# EAGLE design ESP32 - Copy (EAGLE 9.6.2)
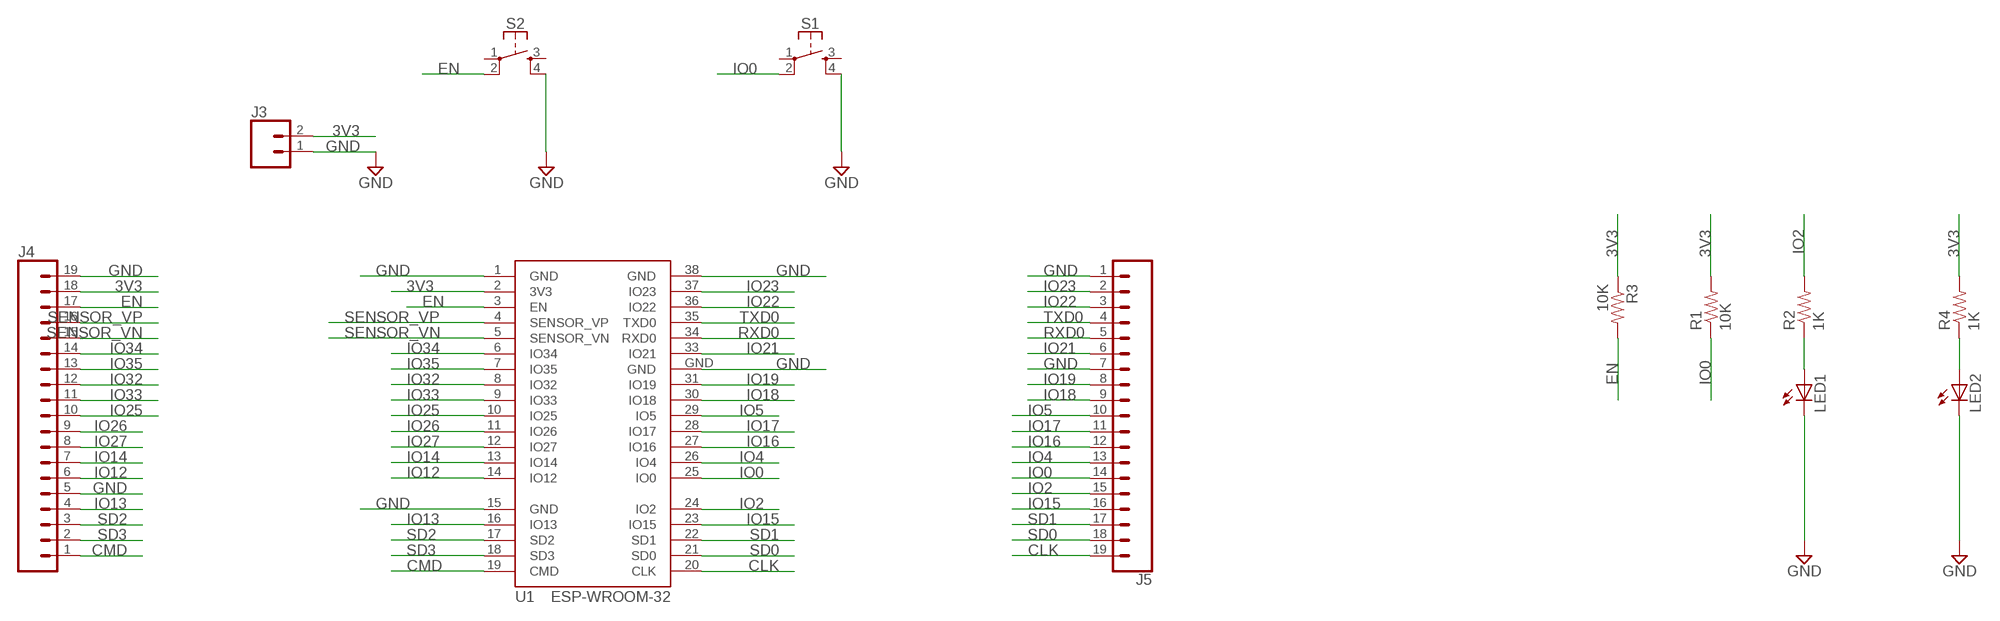
[diagram p0: schematic, sheet 1]

## Parts
J3  CONN_02  [1X02]
J4  CONN_191X19_NO_SILK  [1X19_NO_SILK]
J5  CONN_191X19_NO_SILK  [1X19_NO_SILK]
LED1  LED5MM  [LED5MM]
LED2  LED5MM  [LED5MM]
R1  10K  R-US_0207/10  [0207/10]
R2  1K  R-US_0207/10  [0207/10]
R3  10K  R-US_0207/10  [0207/10]
R4  1K  R-US_0207/10  [0207/10]
S1  MOMENTARY-SWITCH-SPST-2-SMD-5.2MM-TALL  [TACTILE_SWITCH_SMD_5.2MM]
S2  MOMENTARY-SWITCH-SPST-2-SMD-5.2MM-TALL  [TACTILE_SWITCH_SMD_5.2MM]
U1  ESP-WROOM-32  [ESP-WROOM-32]

## Nets
3V3: J3.2 J4.18 R1.2 R3.1 R4.2 U1.2(3V3)
CLK: J5.19 U1.20(CLK)
CMD: J4.1 U1.19(CMD)
EN: J4.17 R3.2 S2.2 U1.3(EN)
GND: J3.1 J4.5 J4.19 J5.1 J5.7 LED1.K(C) LED2.K(C) S1.4 S2.4 U1.1(GND) U1.15(GND) U1.38(GND) U1.GND
IO0: J5.14 R1.1 S1.2 U1.25(IO0)
IO2: J5.15 R2.2 U1.24(IO2)
IO4: J5.13 U1.26(IO4)
IO5: J5.10 U1.29(IO5)
IO12: J4.6 U1.14(IO12)
IO13: J4.4 U1.16(IO13)
IO14: J4.7 U1.13(IO14)
IO15: J5.16 U1.23(IO15)
IO16: J5.12 U1.27(IO16)
IO17: J5.11 U1.28(IO17)
IO18: J5.9 U1.30(IO18)
IO19: J5.8 U1.31(IO19)
IO21: J5.6 U1.33(IO21)
IO22: J5.3 U1.36(IO22)
IO23: J5.2 U1.37(IO23)
IO25: J4.10 U1.10(IO25)
IO26: J4.9 U1.11(IO26)
IO27: J4.8 U1.12(IO27)
IO32: J4.12 U1.8(IO32)
IO33: J4.11 U1.9(IO33)
IO34: J4.14 U1.6(IO34)
IO35: J4.13 U1.7(IO35)
N$1: LED1.A R2.1
N$2: LED2.A R4.1
RXD0: J5.5 U1.34(RXD0)
SD0: J5.18 U1.21(SD0)
SD1: J5.17 U1.22(SD1)
SD2: J4.3 U1.17(SD2)
SD3: J4.2 U1.18(SD3)
SENSOR_VN: J4.15 U1.5(SENSOR_VN)
SENSOR_VP: J4.16 U1.4(SENSOR_VP)
TXD0: J5.4 U1.35(TXD0)
Unconnected: S1.1 S1.3 S2.1 S2.3

## Library data of the parts
J3 = SparkFun-Connectors:CONN_02: Multi connection point. Often used as Generic Header-pin footprint for 0.1 inch spaced/style header connections On any of the 0.1 inch spaced packages, you can populate with these: Break Away Headers - Straight <https://www.sparkfun.com/products/116> (PRT-00116) Break Away Male Headers - Right Angle <https://www.sparkfun.com/products/553> (PRT-00553) Female Headers <https://www.sparkfun.com/products/115> (PRT-00115) Break Away Headers - Machine Pin <https://www.sparkfun.com/products/117> (PRT-00117) Break Away Female Headers - Swiss Machine Pin <https://www.sparkfun.com/products/743> (PRT-00743) For SCREWTERMINALS and SPRING TERMINALS visit here: Screw Terimnals on SparkFun.com <https://www.sparkfun.com/search/results?term=Screw+Terminals> (5mm/3.5mm/2.54mm spacing) This device is also useful as a general connection point to wire up your design to another part of your project. Our various solder wires solder well into these plated through hole pads. Hook-Up Wire - Assortment (Stranded, 22 AWG) <https://www.sparkfun.com/products/11375> (PRT-11375) Hook-Up Wire - Assortment (Solid Core, 22 AWG) <https://www.sparkfun.com/products/11367> (PRT-11367) View the entire wire category on our website here <https://www.sparkfun.com/categories/141> Special notes: Molex polarized connector foot print use with: PRT-08233 with associated crimp pins and housings. 2.54_SCREWTERM for use with PRT-10571. 3.5mm Screw Terminal footprints for PRT-08084 5mm Screw Terminal footprints for use with PRT-08432
J4 J5 = SparkFun-Connectors:CONN_19: Multi connection point. Often used as Generic Header-pin footprint for 0.1 inch spaced/style header connections On any of the 0.1 inch spaced packages, you can populate with these: Break Away Headers - Straight <https://www.sparkfun.com/products/116> (PRT-00116) Break Away Male Headers - Right Angle <https://www.sparkfun.com/products/553> (PRT-00553) Female Headers <https://www.sparkfun.com/products/115> (PRT-00115) Break Away Headers - Machine Pin <https://www.sparkfun.com/products/117> (PRT-00117) Break Away Female Headers - Swiss Machine Pin <https://www.sparkfun.com/products/743> (PRT-00743) For SCREWTERMINALS and SPRING TERMINALS visit here: Screw Terimnals on SparkFun.com <https://www.sparkfun.com/search/results?term=Screw+Terminals> (5mm/3.5mm/2.54mm spacing) This device is also useful as a general connection point to wire up your design to another part of your project. Our various solder wires solder well into these plated through hole pads. Hook-Up Wire - Assortment (Stranded, 22 AWG) <https://www.sparkfun.com/products/11375> (PRT-11375) Hook-Up Wire - Assortment (Solid Core, 22 AWG) <https://www.sparkfun.com/products/11367> (PRT-11367) View the entire wire category on our website here <https://www.sparkfun.com/categories/141> Special notes: Molex polarized connector foot print use with SKU : PRT-08231 with associated crimp pins and housings. 1MM SMD Version SKU: PRT-10208 NOTES ON THE VARIANTS LOCK and LOCK_LONGPADS... This footprint was designed to help hold the alignment of a through-hole component (i.e. 6-pin header) while soldering it into place. You may notice that each hole has been shifted either up or down by 0.005 of an inch from it's more standard position (which is a perfectly straight line). This slight alteration caused the pins (the squares in the middle) to touch the edges of the holes. Because they are alternating, it causes a "brace" to hold the component in place. 0.005 has proven to be the perfect amount of "off-center" position when using our standard breakaway headers. Although looks a little odd when you look at the bare footprint, once you have a header in there, the alteration is very hard to notice. Also,if you push a header all the way into place, it is covered up entirely on the bottom side.
LED1 LED2 = adafruit:LED: LED OSRAM: - CHIPLED LG R971, LG N971, LY N971, LG Q971, LY Q971, LO R971, LY R971 LH N974, LH R974 LS Q976, LO Q976, LY Q976 LO Q996 - Hyper CHIPLED LW Q18S LB Q993, LB Q99A, LB R99A - SideLED LS A670, LO A670, LY A670, LG A670, LP A670 LB A673, LV A673, LT A673, LW A673 LH A674 LY A675 LS A676, LA A676, LO A676, LY A676, LW A676 LS A679, LY A679, LG A679 - Hyper Micro SIDELED® LS Y876, LA Y876, LO Y876, LY Y876 LT Y87S - SmartLED LW L88C, LW L88S LB L89C, LB L89S, LG L890 LS L89K, LO L89K, LY L89K LS L896, LA L896, LO L896, LY L896 - TOPLED LS T670, LO T670, LY T670, LG T670, LP T670 LSG T670, LSP T670, LSY T670, LOP T670, LYG T670 LG T671, LOG T671, LSG T671 LB T673, LV T673, LT T673, LW T673 LH T674 LS T676, LA T676, LO T676, LY T676, LB T676, LH T676, LSB T676, LW T676 LB T67C, LV T67C, LT T67C, LS T67K, LO T67K, LY T67K, LW E67C LS E67B, LA E67B, LO E67B, LY E67B, LB E67C, LV E67C, LT E67C LW T67C LS T679, LY T679, LG T679 LS T770, LO T770, LY T770, LG T770, LP T770 LB T773, LV T773, LT T773, LW T773 LH T774 LS E675, LA E675, LY E675, LS T675 LS T776, LA T776, LO T776, LY T776, LB T776 LHGB T686 LT T68C, LB T68C - Hyper Mini TOPLED® LB M676 - Mini TOPLED Santana® LG M470 LS M47K, LO M47K, LY M47K Source: http://www.osram.convergy.de/
R1-R4 = adafruit:R-US_: RESISTOR, American symbol
S1 S2 = SparkFun-Switches:MOMENTARY-SWITCH-SPST-2: Momentary Switch (Pushbutton) - SPST - Two Circuits Normally-open (NO) SPST momentary switches (buttons, pushbuttons). Schematic symbol includes two switch circuits. Variants SMD-4.6MMX2.8MM - 4.60mm x 2.80mm Tactile Momentary Button Switch - Used on SparkFun SAMD21 Mini Breakout <https://www.sparkfun.com/products/13664> SMD-5.2MM - Mini Pushbutton Switch - SMD <https://www.sparkfun.com/products/8720> - Used on Arduino Pro Mini <https://www.sparkfun.com/products/11114>; PROD_ID: SWCH-14139
U1 = ESP32:ESP-WROOM-32: Espressif Systems ESP-WROOM-32

## Board
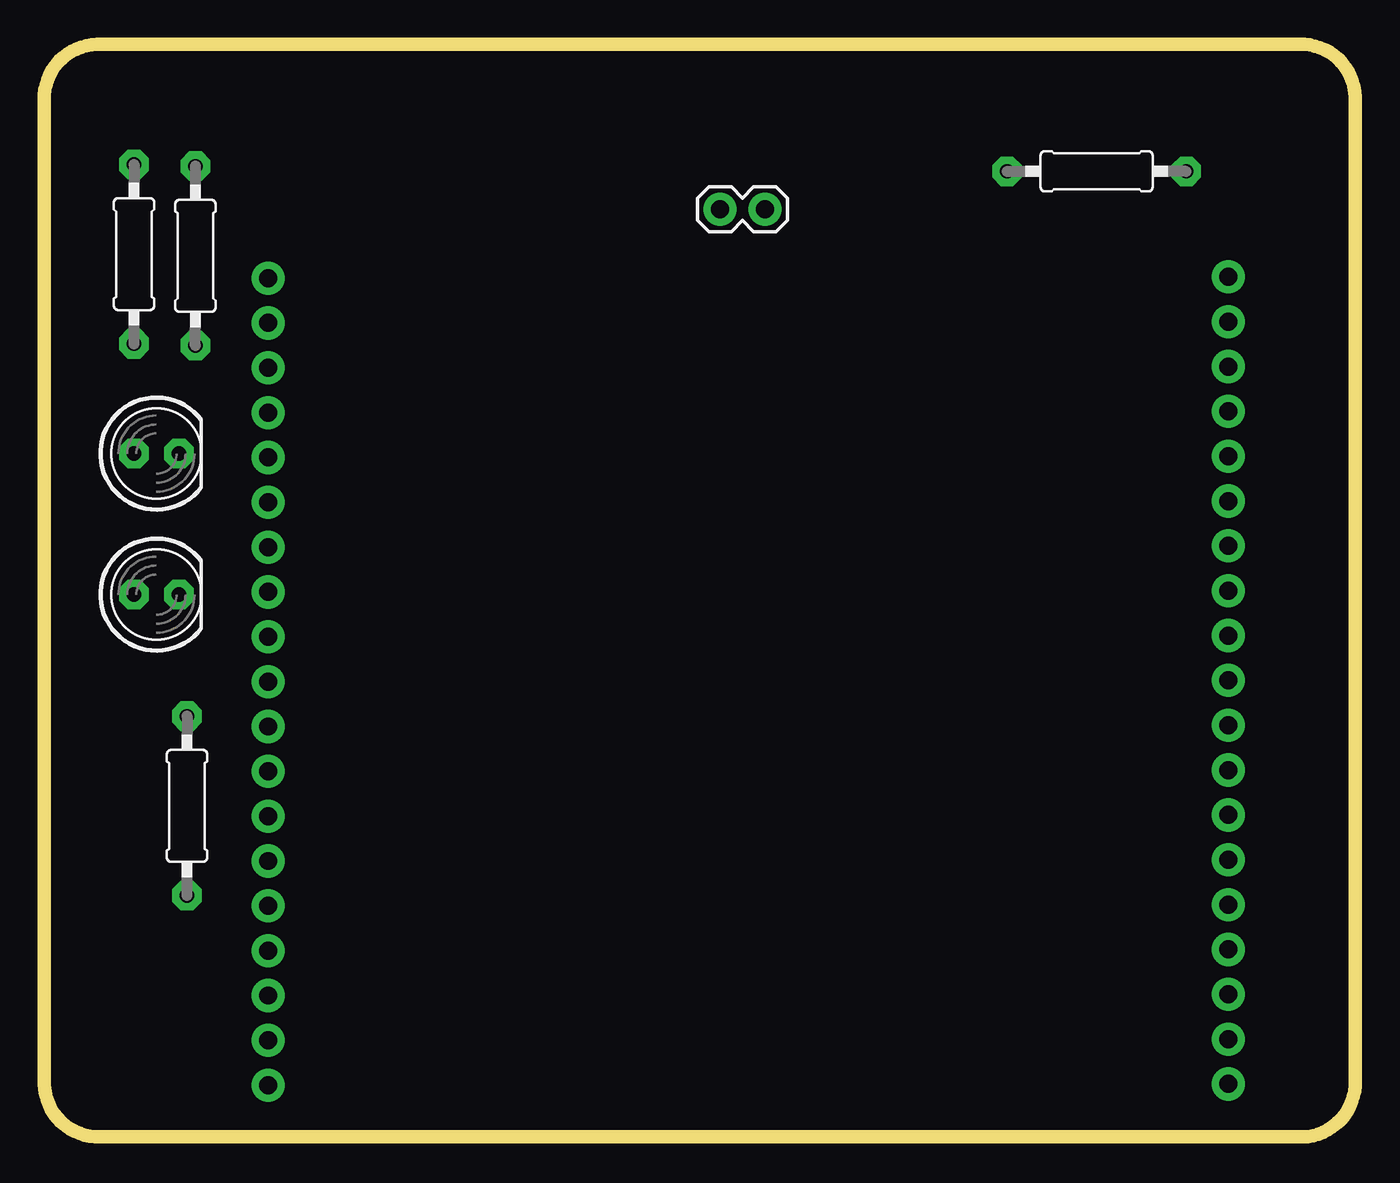
[diagram p1: board, top side]
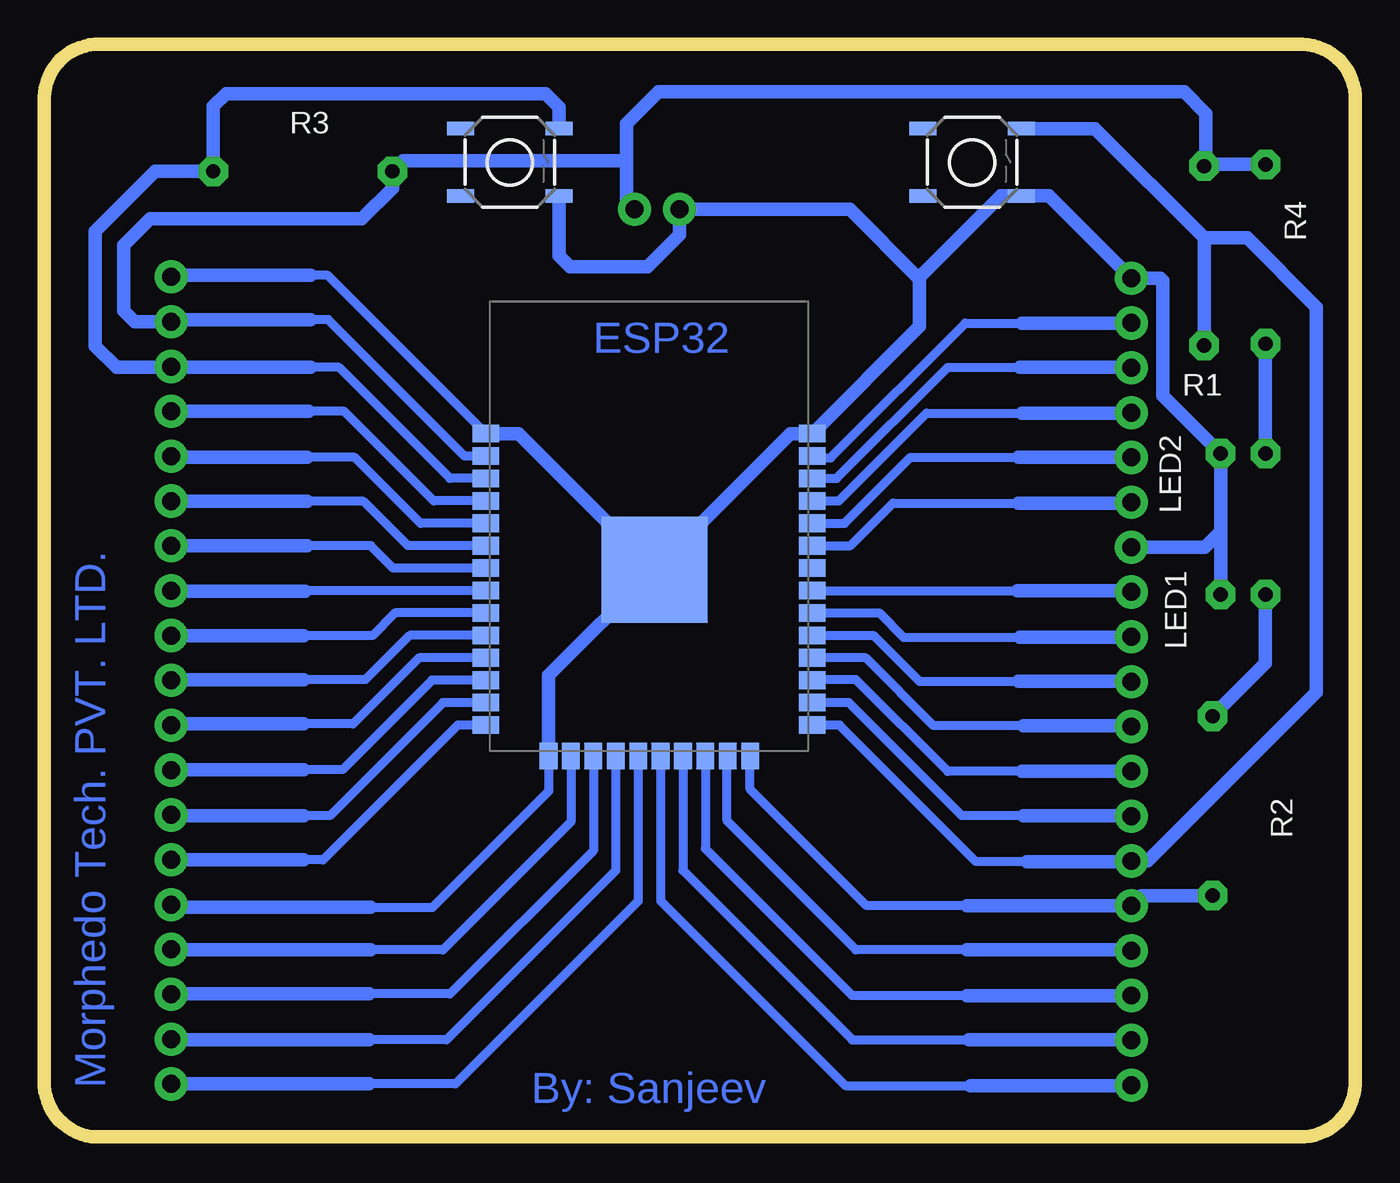
[diagram p2: board, bottom side, seen from below]

Size 74.31 x 61.91 mm. Coordinates in mm from the lower left corner, seen from the top.
Outline: 3.3,61.9 71.1,61.9 arc-96 74.3,58.6 74.3,3.2 arc-96 71,0 3.2,0 arc-96 0,3.3 0,58.7 arc-96 3.3,61.9
Copper layers (1*16): Top 0.035mm / dielectric 1.5mm / Bottom 0.035mm
Design rules "default": minimum track width 6mil, minimum drill 0.35mm, track to track 6mil, track to pad 6mil, pad to pad 6mil, via to via 6mil, smd to smd 6mil, copper to edge 40mil, drill to drill 6mil, minimum pad ring 10mil, minimum via ring 8mil, stop-mask expansion 4mil, vias tented up to drill 0mil, thermal gap 10mil

### Footprints (pad centres in the part's own frame; a part is rotated, then mirrored left to right if it is on the bottom)
1X02 = drill 1.016 pad 1.88: 1 0,0; 2 2.54,0
1X19_NO_SILK = drill 1.016 pad 1.88: 1 0,0; 2 2.54,0; 3 5.08,0; 4 7.62,0; 5 10.16,0; 6 12.7,0; 7 15.24,0; 8 17.78,0; 9 20.32,0; 10 22.86,0; 11 25.4,0; 12 27.94,0; 13 30.48,0; 14 33.02,0; 15 35.56,0; 16 38.1,0; 17 40.64,0; 18 43.18,0; 19 45.72,0
LED5MM = drill 0.813 pad 1.676 octagon: A -1.27,0; K 1.27,0
0207/10 = drill 0.813 pad 1.676 octagon: 1 -5.08,0; 2 5.08,0
TACTILE_SWITCH_SMD_5.2MM = smd 1.524 x 0.762: 1 -2.794,1.905; 2 2.794,1.905; 3 -2.794,-1.905; 4 2.794,-1.905
ESP-WROOM-32 = smd 1.5 x 1: 1 -9.25,7; 2 -9.25,5.73; 3 -9.25,4.46; 4 -9.25,3.19; 5 -9.25,1.92; 6 -9.25,0.65; 7 -9.25,-0.62; 8 -9.25,-1.89; 9 -9.25,-3.16; 10 -9.25,-4.43; 11 -9.25,-5.7; 12 -9.25,-6.97; 13 -9.25,-8.24; 14 -9.25,-9.51; 25 9.25,-9.51; 26 9.25,-8.24; 27 9.25,-6.97; 28 9.25,-5.7; 29 9.25,-4.43; 30 9.25,-3.16; 31 9.25,-1.89; 32 9.25,-0.62; 33 9.25,0.65; 34 9.25,1.92; 35 9.25,3.19; 36 9.25,4.46; 37 9.25,5.73; 38 9.25,7 | smd 1 x 1.5: 15 -5.7,-11.25; 16 -4.43,-11.25; 17 -3.16,-11.25; 18 -1.89,-11.25; 19 -0.62,-11.25; 20 0.65,-11.25; 21 1.92,-11.25; 22 3.19,-11.25; 23 4.46,-11.25; 24 5.73,-11.25 | smd 6 x 6: GND 0.3,-0.7

### Placement (x,y rotation side)
J3  38.3,52.55 0 top
J4  67.1,3 90 top
J5  12.7,48.65 270 top
LED1  6.36,30.72 0 top
LED2  6.36,38.71 0 top
R1  8.57,49.91 90 top
R2  8.09,18.75 270 top
R3  59.64,54.7 0 top
R4  5.09,50.01 90 top
S1  21.71,55.21 0 bottom
S2  47.92,55.21 0 bottom
U1  40.02,32.84 0 bottom

### Tracks (layer width: path | path; a pad name or v marks a point on that pad's centre or on a via)
3V3
  Bottom 0.508: U1.2 50.47,38.57 58.2,46.3 59.2,46.3
  Bottom 0.762: 59.2,46.3 66.98,46.3 J4.18 69.18,46.18 69.8,46.8 69.8,50.5 68.3,52 56.3,52 54.56,53.74 R3.1 53.96,55.3 41.3,55.3 | 41.3,55.3 41.3,57.4 39.5,59.2 9.7,59.2 8.47,57.97 8.47,55.09 | J3.2 41.3,53.01 41.3,55.3 | R4.2 8.47,55.09 | 8.47,55.09 R1.2
CLK
  Bottom 0.508: U1.20 39.37,13.37 28.9,2.9 21.8,2.9
  Bottom 0.762: 21.8,2.9 12.73,2.9 J5.19
CMD
  Bottom 0.508: U1.19 40.64,13.36 51,3 55.9,3
  Bottom 0.762: 55.9,3 J4.1
EN
  Bottom 0.508: U1.3 51.3,37.3 57.6,43.6 59.2,43.6
  Bottom 0.762: J4.17 67.06,43.6 | 59.2,43.6 67.06,43.6 | 67.06,43.6 70.2,43.6 71.4,44.8 71.4,51.3 68,54.7 R3.2 64.72,58.38 64,59.1 45.9,59.1 45.13,58.33 S2.2
GND
  Bottom 0.508: 55.8,13 52.3,13 45.7,19.6 45.7,21.57 U1.15 | U1.1 58.23,48.8 59.2,48.8
  Bottom 0.762: J4.19 67.02,48.8 59.2,48.8 | J4.5 66.94,13 55.8,13 | U1.GND 32.02,39.84 U1.38 24.7,45.91 24.7,48.8 24.6,48.8 | U1.1 47.42,39.84 U1.GND | U1.15 45.72,26.14 U1.GND | 24.6,48.8 20.1,53.31 S1.4 17.36,53.31 J5.1 11.05,48.65 10.9,48.5 10.9,41.98 LED2.K 7.63,34.3 | 24.6,48.8 24.75,48.65 28.65,52.55 J3.1 38.3,51.1 40.1,49.3 44.5,49.3 45.13,49.93 S2.4 | 7.63,34.3 LED1.K | J5.7 8.52,33.41 7.63,34.3
IO0
  Bottom 0.508: 18.6,15.6 21.5,15.6 29.23,23.33 U1.25
  Bottom 0.762: 18.6,15.6 12.73,15.6 J5.14 11.77,15.63 2.2,25.2 2.2,47 6.13,50.93 8.57,50.93 | S1.2 14.76,57.12 8.57,50.93 | 8.57,50.93 R1.1
IO2
  Bottom 0.508: 22,13.1 27.7,13.1 34.3,19.7 U1.24
  Bottom 0.762: 22,13.1 J5.15 12.12,13.67 R2.2
IO4
  Bottom 0.508: 18.8,18.2 22.3,18.2 28.7,24.6 U1.26
  Bottom 0.762: J5.13 12.73,18.2 18.8,18.2
IO5
  Bottom 0.508: U1.29 27.31,28.41 24.7,25.8 19.1,25.8
  Bottom 0.762: J5.10 19.1,25.8
IO12
  Bottom 0.508: U1.14 50.87,23.33 58.5,15.7 59.6,15.7
  Bottom 0.762: 59.6,15.7 J4.6
IO13
  Bottom 0.508: U1.16 44.45,17.85 51.7,10.6 55.8,10.6
  Bottom 0.762: 55.8,10.6 67.08,10.6 J4.4
IO14
  Bottom 0.508: U1.13 51.7,24.6 58.1,18.2 59.6,18.2
  Bottom 0.762: J4.7 67.06,18.2 59.6,18.2
IO15
  Bottom 0.508: 22,10.6 28.3,10.6 35.6,17.9 35.6,21.55 U1.23
  Bottom 0.762: J5.16 12.75,10.6 22,10.6
IO16
  Bottom 0.508: 18.9,20.7 23.1,20.7 28.3,25.9 30.74,25.9 U1.27
  Bottom 0.762: J5.12 18.9,20.7
IO17
  Bottom 0.508: 18.8,23.3 23.9,23.3 27.74,27.14 U1.28
  Bottom 0.762: 18.8,23.3 12.75,23.3 J5.11
IO18
  Bottom 0.508: U1.30 26.98,29.68 25.6,28.3 19,28.3
  Bottom 0.762: 19,28.3 12.73,28.3 J5.9
IO19
  Bottom 0.508: U1.31 19.15,30.95
  Bottom 0.762: 19.15,30.95 12.78,30.95 J5.8
IO21
  Bottom 0.508: U1.33 28.61,33.49 26.2,35.9 19.1,35.9
  Bottom 0.762: J5.6 12.75,35.9 19.1,35.9
IO22
  Bottom 0.508: U1.36 29.4,37.3 23.1,43.6 19,43.6
  Bottom 0.762: 19,43.6 12.73,43.6 J5.3
IO23
  Bottom 0.508: U1.37 30.67,38.47 29.73,38.47 22.1,46.1 18.9,46.1
  Bottom 0.762: J5.2 18.9,46.1
IO25
  Bottom 0.508: U1.10 53.59,28.41 56.1,25.9 59.6,25.9
  Bottom 0.762: J4.10 67.06,25.9 59.6,25.9
IO26
  Bottom 0.508: U1.11 53.06,27.14 56.8,23.4 59.6,23.4
  Bottom 0.762: J4.9 67.02,23.4 59.6,23.4
IO27
  Bottom 0.508: U1.12 52.33,25.87 57.4,20.8 59.6,20.8
  Bottom 0.762: J4.8 67.08,20.8 59.6,20.8
IO32
  Bottom 0.508: U1.8 59.45,30.95 59.5,30.9
  Bottom 0.762: J4.12 67.06,30.9 59.5,30.9
IO33
  Bottom 0.508: U1.9 54.42,29.68 55.7,28.4 59.6,28.4
  Bottom 0.762: 59.6,28.4 J4.11
IO34
  Bottom 0.508: U1.6 53.69,33.49 56.2,36 59.4,36
  Bottom 0.762: J4.14 67.08,36 59.4,36
IO35
  Bottom 0.508: U1.7 54.52,32.22 55.8,33.5 59.9,33.5
  Bottom 0.762: J4.13 67.08,33.5 59.9,33.5 59.4,33.5
N$1
  Bottom 0.762: 8.11,23.85 R2.1 5.09,26.83 LED1.A
N$2
  Bottom 0.762: R4.1 LED2.A
RXD0
  Bottom 0.508: U1.34 28.94,34.76 25.2,38.5 19.1,38.5
  Bottom 0.762: 19.1,38.5 J5.5
SD0
  Bottom 0.508: U1.21 38.1,15.1 28.5,5.5 21.9,5.5
  Bottom 0.762: 21.9,5.5 12.73,5.5 J5.18
SD1
  Bottom 0.508: U1.22 36.83,16.33 28.5,8 22,8
  Bottom 0.762: J5.17 22,8
SD2
  Bottom 0.508: U1.17 43.18,16.22 51.3,8.1 55.9,8.1
  Bottom 0.762: 55.9,8.1 67.08,8.1 J4.3
SD3
  Bottom 0.508: U1.18 41.91,15.09 51.5,5.5 55.9,5.5
  Bottom 0.762: 55.9,5.5 67.06,5.5 J4.2
SENSOR_VN
  Bottom 0.508: U1.5 52.96,34.76 56.7,38.5 59.4,38.5
  Bottom 0.762: J4.15 67.04,38.5 59.4,38.5
SENSOR_VP
  Bottom 0.508: U1.4 52.23,36.03 57.3,41.1 59.3,41.1
  Bottom 0.762: 59.3,41.1 J4.16
TXD0
  Bottom 0.508: U1.35 29.27,36.03 24.3,41 18.9,41
  Bottom 0.762: J5.4 12.73,41 18.9,41

### Text on the board
Bottom: ESP32 | Morphedo Tech. PVT. LTD. | By: Sanjeev